# EAGLE design sce (EAGLE 6.2)
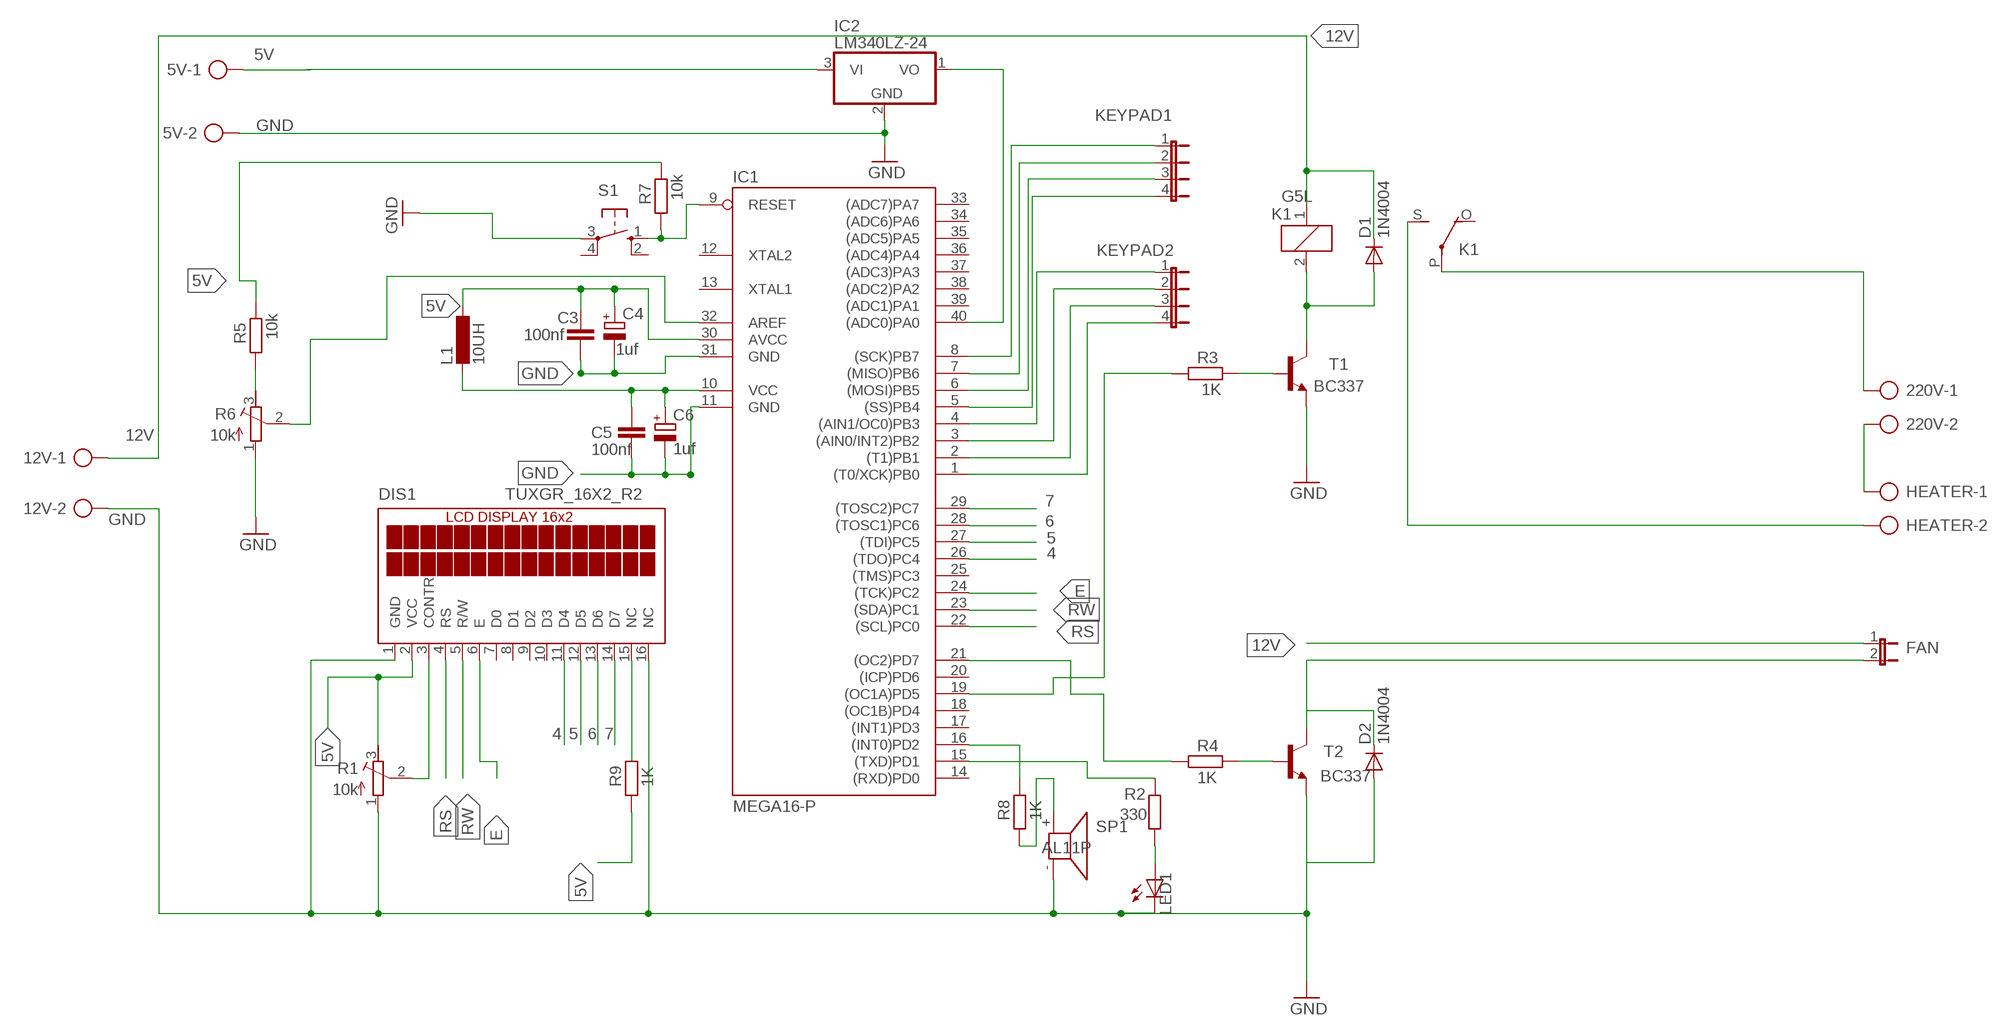
[diagram p0: schematic, sheet 1]

## Parts
5V  AK500/2  [AK500/2]
12V  AK500/2  [AK500/2]
220V  AK500/2  [AK500/2]
C3  100nf  C-EU025-025X050  [C025-025X050]
C4  1uf  CPOL-EUE2.5-5  [E2,5-5]
C5  100nf  C-EU025-025X050  [C025-025X050]
C6  1uf  CPOL-EUE2.5-5  [E2,5-5]
D1  1N4004  [DO41-10]
D2  1N4004  [DO41-10]
DIS1  TUXGR_16X2_R2  [TUXGR_16X2_R2]
FAN  JP1E  [JP1]
HEATER  AK500/2  [AK500/2]
IC1  MEGA16-P  [DIL40]
IC2  LM340LZ-24  [TO92]
K1  G5L  [G5LE]
KEYPAD1  JP4E  [JP4]
KEYPAD2  JP4E  [JP4]
L1  10UH  L-EU6000-XXX-RC  [6000-XXXX-RC]
LED1  LED5MM  [LED5MM]
R1  10k  R-TRIMM3339P  [RTRIM3339P]
R2  330  R-EU_0207/10  [0207/10]
R3  1K  R-EU_0207/10  [0207/10]
R4  1K  R-EU_0207/10  [0207/10]
R5  10k  R-EU_0207/10  [0207/10]
R6  10k  R-TRIMM3339P  [RTRIM3339P]
R7  10k  R-EU_0207/10  [0207/10]
R8  1K  R-EU_0207/10  [0207/10]
R9  1K  R-EU_0207/10  [0207/10]
S1  10-XX  [B3F-10XX]
SP1  AL11P  [AL11P]
T1  BC337  [TO92]
T2  BC337  [TO92]

## Nets
1: C5.1 C6.+ IC1.10(VCC) L1.2
4: DIS1.11(D4) IC1.26((TDO)PC4)
5: DIS1.12(D5) IC1.27((TDI)PC5)
5V: 5V.1 C3.1 C4.+ DIS1.2(VCC) IC1.30(AVCC) IC2.3(VI) L1.1 R1.3(E) R5.2 R7.2 R9.1
6: DIS1.13(D6) IC1.28((TOSC1)PC6)
7: DIS1.14(D7) IC1.29((TOSC2)PC7)
12V: 12V.1 D1.C FAN.1 K1.1
E: DIS1.6(E) IC1.24((TCK)PC2)
GND: 5V.2 12V.2 C3.2 C4.- C5.2 C6.- D2.A DIS1.1(GND) DIS1.16(NC) IC1.11(GND) IC1.31(GND) IC2.2(GND) LED1.K(C) R1.1(A) R6.1(A) SP1.- T1.1(E) T2.1(E)
HOT: IC1.40((ADC0)PA0) IC2.1(VO)
KEYPAD2: IC1.1((T0/XCK)PB0) KEYPAD2.4
N$1: S1.3(P) ; supply symbol labelled GND
N$2: IC1.9(RESET) R7.1 S1.1(S)
N$3: R4.2 T2.2(B)
N$4: R3.2 T1.2(B)
N$5: IC1.21((OC2)PD7) R4.1
N$6: IC1.3((AIN0/INT2)PB2) KEYPAD2.2
N$7: IC1.19((OC1A)PD5) R3.1
N$8: D1.A K1.2 T1.3(C)
N$9: IC1.5((SS)PB4) KEYPAD1.4
N$10: 220V.1 K1.P(2:P)
N$11: 220V.2 HEATER.1
N$12: IC1.16((INT0)PD2) R8.2
N$13: IC1.2((T1)PB1) KEYPAD2.3
N$14: HEATER.2 K1.S(2:S)
N$15: IC1.4((AIN1/OC0)PB3) KEYPAD2.1
N$16: D2.C FAN.2 T2.3(C)
N$17: IC1.15((TXD)PD1) R2.2
N$18: DIS1.3(CONTR) R1.2(S)
N$19: IC1.6((MOSI)PB5) KEYPAD1.3
N$20: LED1.A R2.1
N$21: IC1.7((MISO)PB6) KEYPAD1.2
N$22: R8.1 SP1.+
N$23: IC1.8((SCK)PB7) KEYPAD1.1
N$24: IC1.32(AREF) R6.2(S)
N$25: R5.1 R6.3(E)
N$26: DIS1.15(NC)
RS: DIS1.4(RS) IC1.22((SCL)PC0)
RW: DIS1.5(R/W) IC1.23((SDA)PC1)
Unconnected: DIS1.7(D0) DIS1.8(D1) DIS1.9(D2) DIS1.10(D3) IC1.12(XTAL2) IC1.13(XTAL1) IC1.14((RXD)PD0) IC1.17((INT1)PD3) IC1.18((OC1B)PD4) IC1.20((ICP)PD6) IC1.25((TMS)PC3) IC1.33((ADC7)PA7) IC1.34((ADC6)PA6) IC1.35((ADC5)PA5) IC1.36((ADC4)PA4) IC1.37((ADC3)PA3) IC1.38((ADC2)PA2) IC1.39((ADC1)PA1) K1.O(2:O) R9.2 S1.2(S1) S1.4(P1)

## Library data of the parts
5V 12V 220V HEATER = con-ptr500:AK500/2: CONNECTOR; OC_FARNELL: unknown; OC_NEWARK: unknown
C3 C5 = rcl:C-EU: CAPACITOR, European symbol
C4 C6 = rcl:CPOL-EU: POLARIZED CAPACITOR, European symbol
D1 D2 = diode:1N4004: DIODE general purpose rectifier, 1 A
DIS1 = display-lcd:TUXGR_16X2_R2: Tuxgraphics LCD display 16x2 characters reflective, without background light Source: tuxgr_12x2_r2.pdf; OC_FARNELL: unknown; OC_NEWARK: unknown
FAN = jumper:JP1E: JUMPER
IC1 = atmel:MEGA16-P: MICROCONTROLLER 16 Kbytes FLASH 1 kbytes SRAM 512 bytes EEPROM USART 8-channel 10 bit ADC Source: avr.lbr; MPN: ATMEGA16-16PU; OC_FARNELL: 9171142; OC_NEWARK: 01M6885
IC2 = linear:LM340?-*: Positive VOLTAGE REGULATOR Source: http://cache.national.com/ds/LM/LM340.pdf
K1 = relay:G5L: RELAY 1 x switch, 10 A/120 V AC, 8 A/30 V ADC, Omron; OC_FARNELL: unknown; OC_NEWARK: unknown
KEYPAD1 KEYPAD2 = jumper:JP4E: JUMPER
L1 = rcl:L-EU: INDUCTOR, European symbol
LED1 = led:LED: LED OSRAM: - CHIPLED LG R971, LG N971, LY N971, LG Q971, LY Q971, LO R971, LY R971 LH N974, LH R974 LS Q976, LO Q976, LY Q976 LO Q996 - Hyper CHIPLED LW Q18S LB Q993, LB Q99A, LB R99A - SideLED LS A670, LO A670, LY A670, LG A670, LP A670 LB A673, LV A673, LT A673, LW A673 LH A674 LY A675 LS A676, LA A676, LO A676, LY A676, LW A676 LS A679, LY A679, LG A679 - Hyper Micro SIDELED® LS Y876, LA Y876, LO Y876, LY Y876 LT Y87S - SmartLED LW L88C, LW L88S LB L89C, LB L89S, LG L890 LS L89K, LO L89K, LY L89K LS L896, LA L896, LO L896, LY L896 - TOPLED LS T670, LO T670, LY T670, LG T670, LP T670 LSG T670, LSP T670, LSY T670, LOP T670, LYG T670 LG T671, LOG T671, LSG T671 LB T673, LV T673, LT T673, LW T673 LH T674 LS T676, LA T676, LO T676, LY T676, LB T676, LH T676, LSB T676, LW T676 LB T67C, LV T67C, LT T67C, LS T67K, LO T67K, LY T67K, LW E67C LS E67B, LA E67B, LO E67B, LY E67B, LB E67C, LV E67C, LT E67C LW T67C LS T679, LY T679, LG T679 LS T770, LO T770, LY T770, LG T770, LP T770 LB T773, LV T773, LT T773, LW T773 LH T774 LS E675, LA E675, LY E675, LS T675 LS T776, LA T776, LO T776, LY T776, LB T776 LHGB T686 LT T68C, LB T68C - Hyper Mini TOPLED® LB M676 - Mini TOPLED Santana® LG M470 LS M47K, LO M47K, LY M47K Source: http://www.osram.convergy.de LUXEON: - LUMILED® LXK2-PW12-R00, LXK2-PW12-S00, LXK2-PW14-U00, LXK2-PW14-V00 LXK2-PM12-R00, LXK2-PM12-S00, LXK2-PM14-U00 LXK2-PE12-Q00, LXK2-PE12-R00, LXK2-PE12-S00, LXK2-PE14-T00, LXK2-PE14-U00 LXK2-PB12-K00, LXK2-PB12-L00, LXK2-PB12-M00, LXK2-PB14-N00, LXK2-PB14-P00, LXK2-PB14-Q00 LXK2-PR12-L00, LXK2-PR12-M00, LXK2-PR14-Q00, LXK2-PR14-R00 LXK2-PD12-Q00, LXK2-PD12-R00, LXK2-PD12-S00 LXK2-PH12-R00, LXK2-PH12-S00 LXK2-PL12-P00, LXK2-PL12-Q00, LXK2-PL12-R00 Source: www.luxeon.com KINGBRIGHT: KA-3528ASYC Source: www.kingbright.com
R1 R6 = rcl:R-TRIMM: Trimm resistor
R2-R5 R7-R9 = rcl:R-EU_: RESISTOR, European symbol
S1 = switch-omron:10-XX: OMRON SWITCH; MPN: B3F-1000; OC_FARNELL: 176432; OC_NEWARK: 36M3542
SP1 = buzzer:AL11P: SPEAKER Source: Buerklin; OC_FARNELL: unknown; OC_NEWARK: unknown
T1 T2 = transistor:BC337: NPN TRANSISTOR

## Board
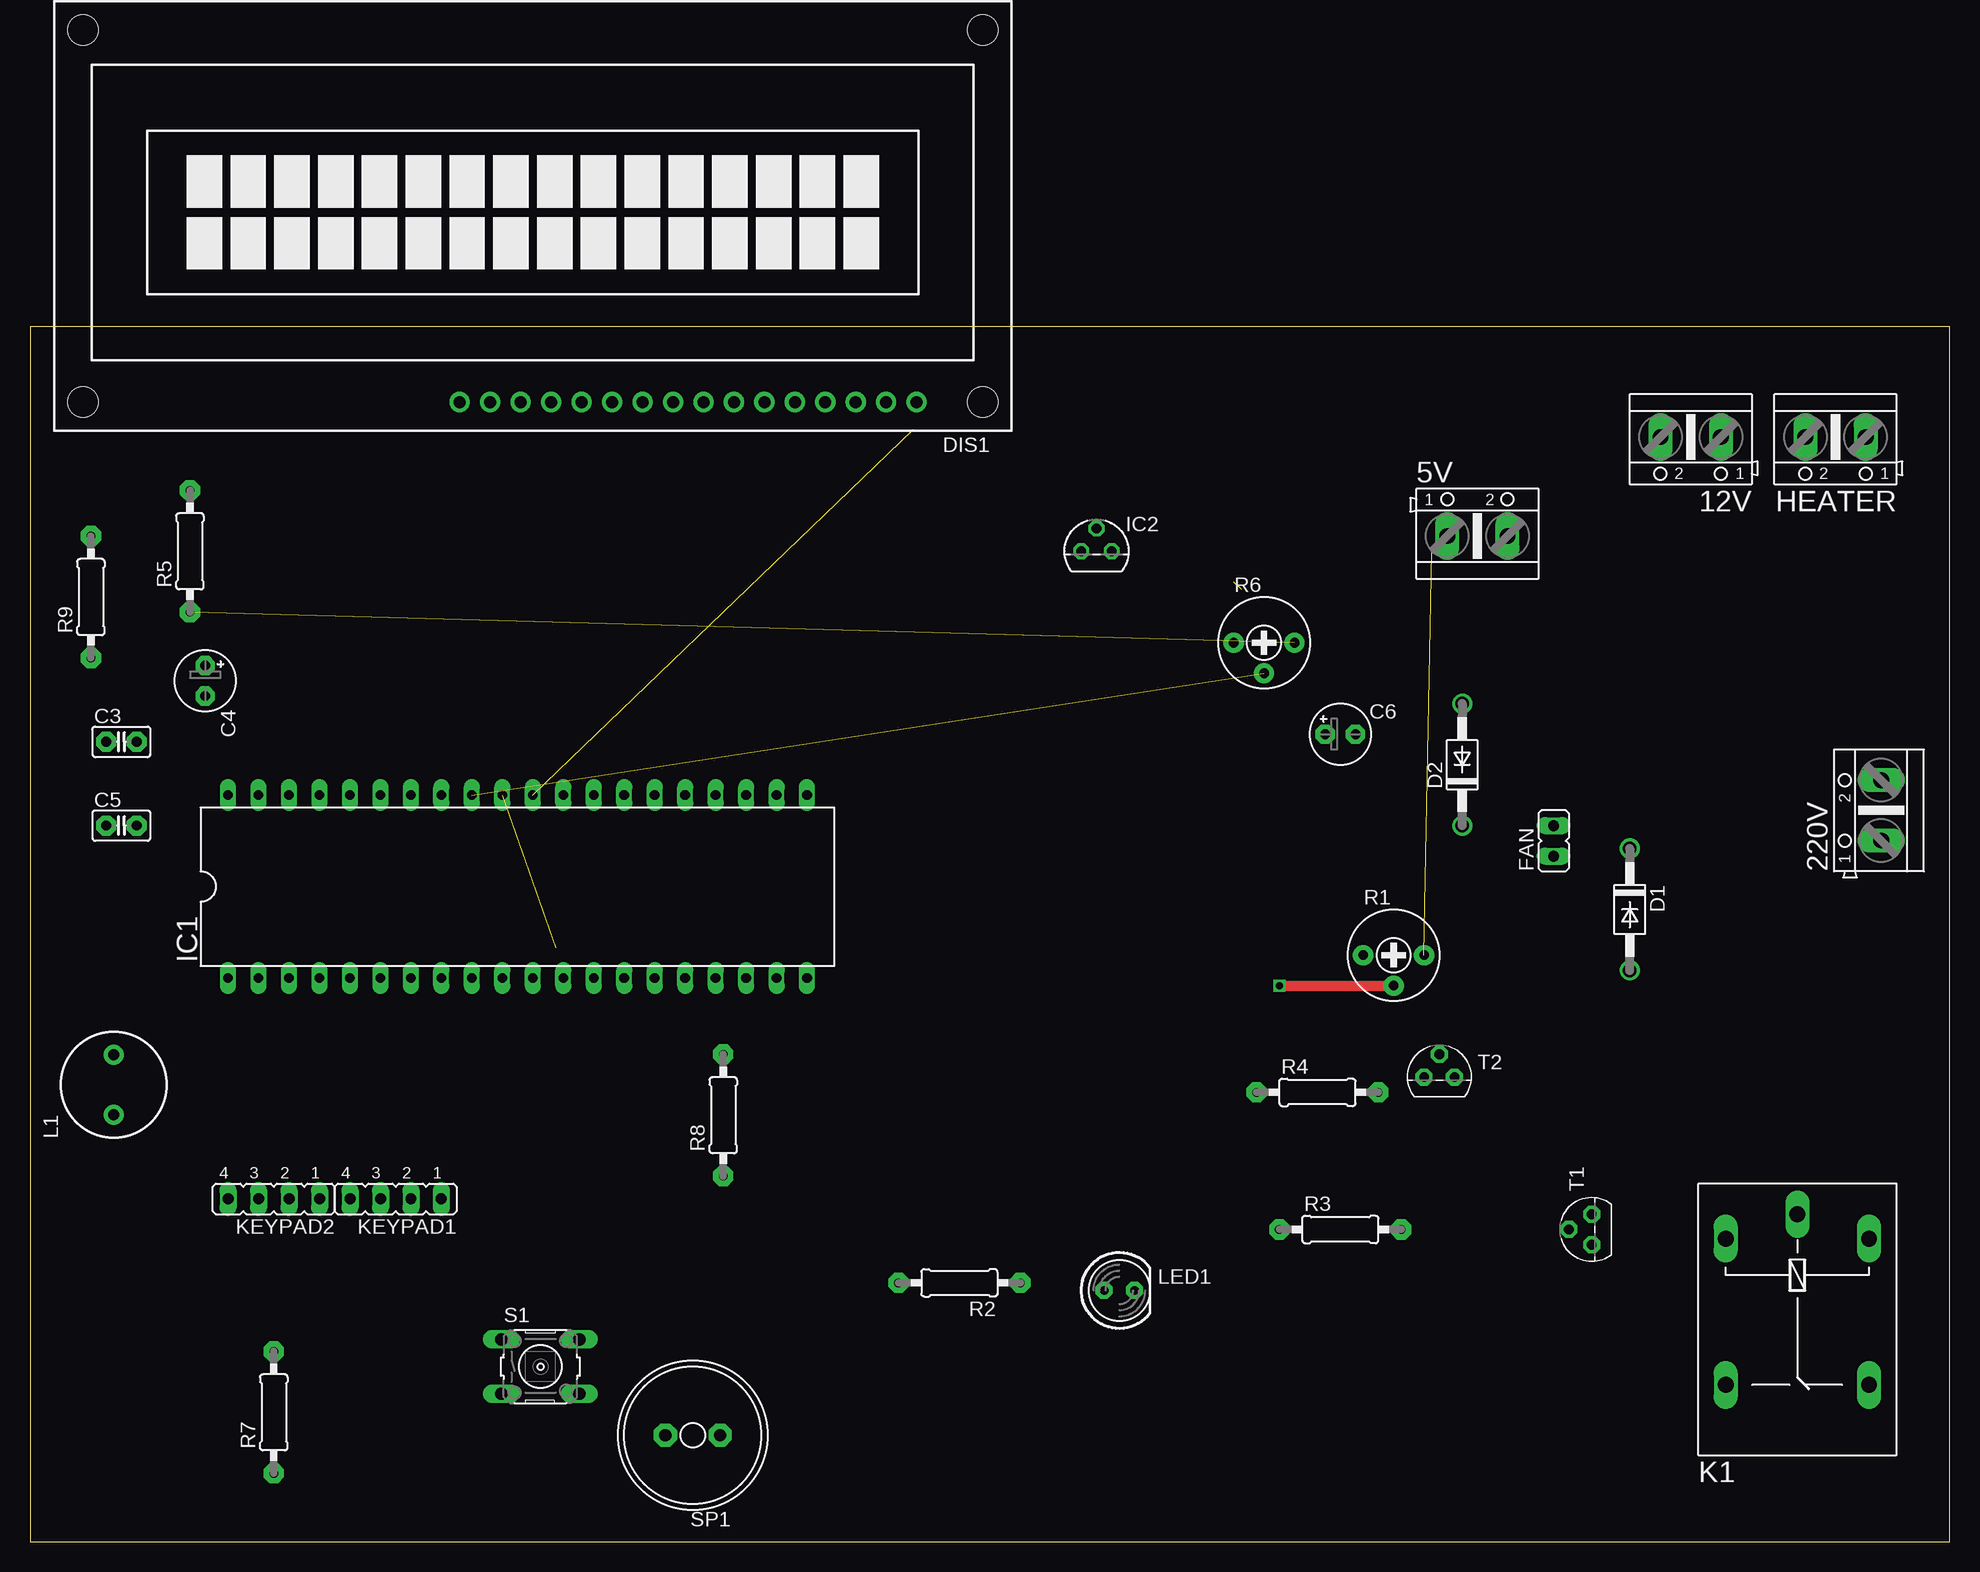
[diagram p1: board, top side]
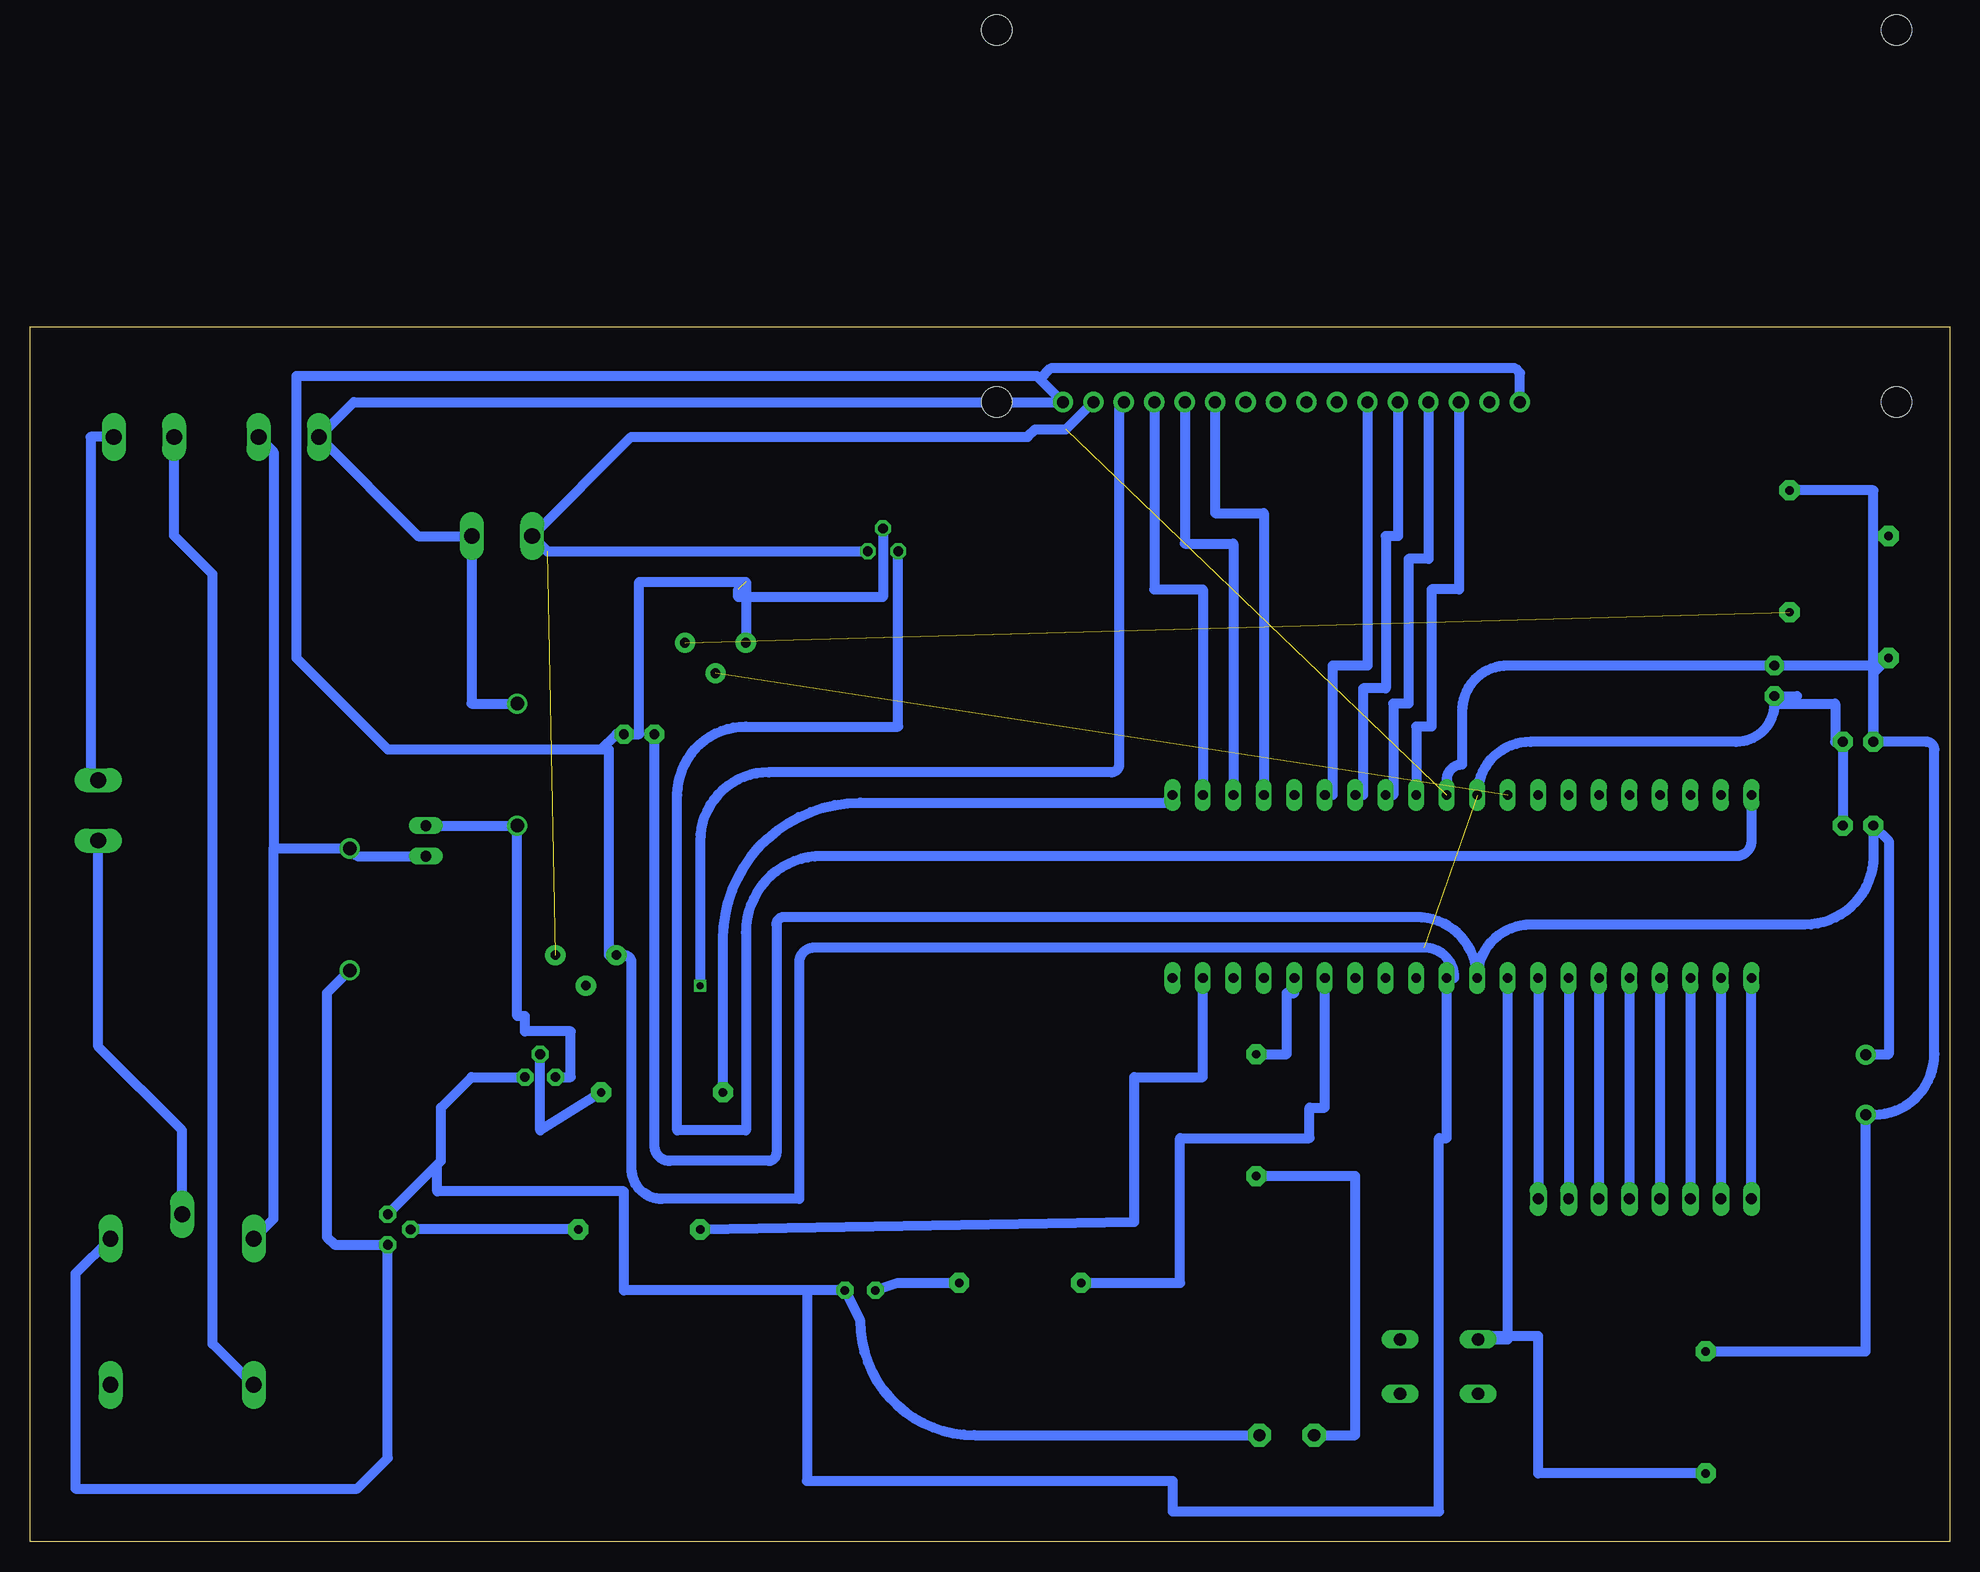
[diagram p2: board, bottom side, seen from below]

Size 160 x 101.27 mm. Coordinates in mm from the lower left corner, seen from the top.
Outline: 0,0 160,0 160,101.27 0,101.27 0,0
Copper layers (1*16): Top 0.035mm / dielectric 1.5mm / Bottom 0.035mm
Design rules: minimum track width 10mil, minimum drill 24mil, track to track 8mil, track to pad 8mil, pad to pad 8mil, via to via 8mil, smd to smd 8mil, copper to edge 40mil, drill to drill 8mil, minimum pad ring 10mil, minimum via ring 8mil, stop-mask expansion 4mil, vias tented up to drill 0mil, thermal gap 10mil

### Footprints (pad centres in the part's own frame; a part is rotated, then mirrored left to right if it is on the bottom)
AK500/2 = drill 1.321 long: 1 -2.515,0; 2 2.515,0
C025-025X050 = drill 0.813 pad 1.676 octagon: 1 -1.27,0; 2 1.27,0
E2,5-5 = drill 0.813 pad 1.6 octagon: + -1.27,0; - 1.27,0
DO41-10 = drill 1.118: A 5.08,0; C -5.08,0
TUXGR_16X2_R2 = drill 1 pad 1.676: 1 -32,15.5; 2 -29.46,15.5; 3 -26.92,15.5; 4 -24.38,15.5; 5 -21.84,15.5; 6 -19.3,15.5; 7 -16.76,15.5; 8 -14.22,15.5; 9 -11.68,15.5; 10 -9.14,15.5; 11 -6.6,15.5; 12 -4.06,15.5; 13 -1.52,15.5; 14 1.02,15.5; 15 3.56,15.5; 16 6.1,15.5 | hole 2.5: -37.5,-15.5; 37.5,-15.5; -37.5,15.5; 37.5,15.5
JP1 = drill 0.914 long: 1 0,-1.27; 2 0,1.27
DIL40 = drill 0.813 long: 1 -24.13,-7.62; 2 -21.59,-7.62; 3 -19.05,-7.62; 4 -16.51,-7.62; 5 -13.97,-7.62; 6 -11.43,-7.62; 7 -8.89,-7.62; 8 -6.35,-7.62; 9 -3.81,-7.62; 10 -1.27,-7.62; 11 1.27,-7.62; 12 3.81,-7.62; 13 6.35,-7.62; 14 8.89,-7.62; 15 11.43,-7.62; 16 13.97,-7.62; 17 16.51,-7.62; 18 19.05,-7.62; 19 21.59,-7.62; 20 24.13,-7.62; 21 24.13,7.62; 22 21.59,7.62; 23 19.05,7.62; 24 16.51,7.62; 25 13.97,7.62; 26 11.43,7.62; 27 8.89,7.62; 28 6.35,7.62; 29 3.81,7.62; 30 1.27,7.62; 31 -1.27,7.62; 32 -3.81,7.62; 33 -6.35,7.62; 34 -8.89,7.62; 35 -11.43,7.62; 36 -13.97,7.62; 37 -16.51,7.62; 38 -19.05,7.62; 39 -21.59,7.62; 40 -24.13,7.62
TO92 = drill 0.813 octagon: 1 -1.27,0; 2 0,1.905; 3 1.27,0
G5LE = drill 1.321 long: 1 -7.493,-5.969; 2 -7.493,5.969; O 4.699,5.969; P -9.525,0; S 4.699,-5.969
JP4 = drill 0.914 long: 1 -3.81,0; 2 -1.27,0; 3 1.27,0; 4 3.81,0
6000-XXXX-RC = drill 0.9 pad 1.676: 1 -2.5,0; 2 2.5,0
LED5MM = drill 0.7 pad 1.422 octagon: A -1.27,0; K 1.27,0
RTRIM3339P = drill 0.8 pad 1.676: 1 -2.54,0; 2 0,-2.54; 3 2.54,0
0207/10 = drill 0.7 pad 1.676 octagon: 1 -5.08,0; 2 5.08,0
B3F-10XX = drill 1.016 long: 1 -3.251,2.261; 2 3.251,2.261; 3 -3.251,-2.261; 4 3.251,-2.261
AL11P = drill 1.016 pad 1.93 octagon: + 2.286,0; - -2.286,0
TO92' = drill 0.813 pad 1.422 octagon: 1 1.27,0; 2 0,1.905; 3 -1.27,0

### Placement (x,y rotation side)
5V  120.65,83.82 0 top
12V  138.43,92.08 180 top
220V  154.31,60.96 90 top
C3  7.62,66.67 0 top
C4  14.61,71.75 270 top
C5  7.62,59.69 0 top
C6  109.22,67.31 0 top
D1  133.35,52.7 270 top
D2  119.38,64.77 90 top
DIS1  41.91,110.49 180 top
FAN  127,58.42 0 top
HEATER  150.5,92.08 180 top
IC1  40.64,54.61 0 top
IC2  88.9,82.55 0 top
K1  147.32,17.78 270 top
KEYPAD1  30.48,28.57 180 top
KEYPAD2  20.32,28.57 180 top
L1  6.99,38.1 90 top
LED1  90.81,20.95 0 top
R1  113.67,48.9 0 top
R2  77.47,21.59 180 top
R3  109.22,26.04 0 top
R4  107.31,37.47 0 top
R5  13.34,82.55 90 top
R6  102.87,74.93 0 top
R7  20.32,10.79 90 top
R8  57.78,35.56 90 top
R9  5.08,78.74 90 top
S1  42.55,14.61 0 top
SP1  55.24,8.89 180 top
T1  BC337  [TO92']  130.18,26.04 90 top
T2  BC337  [TO92']  117.47,38.73 0 top

### Tracks (layer width: path | path; a pad name or v marks a point on that pad's centre or on a via)
1
  Bottom 0.813: L1.2 5.12,40.6 5.08,40.64 5.08,58.42 C5.1 6.35,57.15 arc90 12.06,51.44 34.92,51.44 arc-90 IC1.10 arc-90 44.45,52.07 97.16,52.07 arc-90 97.79,51.44 97.79,32.38 arc90 98.42,31.75 106.68,31.75 arc90 107.95,33.02 C6.+
4
  Bottom 0.813: DIS1.11 48.51,73.03 51.44,73.03 51.44,62.23 IC1.26
5
  Bottom 0.813: DIS1.12 45.97,83.82 46.99,83.82 46.99,71.12 48.9,71.12 48.9,62.23 IC1.27
5V  (2 unrouted)
  Bottom 0.813: DIS1.2 73.66,92.71 76.2,92.71 76.83,92.08 109.88,92.08 5V.1 116.86,82.55 IC2.3 | R9.1 6.35,72.39 | 6.35,72.39 C3.1 | 6.35,72.39 6.35,73.03 C4.+ 36.83,73.03 arc-90 40.64,69.22 40.64,64.77 arc-90 41.91,63.5 IC1.30 | C3.1 6.35,87.63 R5.2 | R7.2 6.99,15.88 L1.1 6.31,35.6 arc-90 1.27,40.64 1.27,66.04 arc-90 1.91,66.67 C3.1
6
  Bottom 0.813: DIS1.13 43.43,81.92 45.09,81.92 45.09,69.85 46.35,69.85 46.35,62.23 IC1.28
7
  Bottom 0.813: DIS1.14 40.89,79.38 43.18,79.38 43.18,67.94 44.45,67.94 IC1.29
12V
  Bottom 0.813: K1.1 139.7,26.92 139.7,57.78 | 139.7,57.78 D1.C 132.72,57.15 FAN.1 | 12V.1 139.7,90.83 139.7,57.78
E
  Bottom 0.813: DIS1.6 61.21,85.72 57.15,85.72 IC1.24
GND  (2 unrouted)
  Bottom 0.813: D2.A 123.19,69.85 123.19,83.8 5V.2 127.66,83.82 12V.2 133,94.99 DIS1.1 75.82,96.9 | T1.1 126.05,31.43 | 126.05,31.43 125.73,31.75 125.73,36.2 123.19,38.73 T2.1 | C5.2 C3.2 9.53,66.67 9.53,69.85 14.61,69.85 | 75.82,96.9 76.08,97.16 137.79,97.16 137.79,73.66 130.18,66.04 112.39,66.04 | 112.39,66.04 111.12,67.31 C6.- 109.22,67.31 109.22,80.01 100.33,80.01 R6.1 | 14.61,69.85 C4.- 12.7,70.48 | SP1.- 81.28,8.89 arc90 90.81,18.41 LED1.K 95.25,20.95 | 95.25,20.95 95.25,5.08 64.77,5.08 64.77,2.54 42.55,2.54 42.55,33.66 41.91,33.66 IC1.11 41.27,46.99 arc-90 43.81,49.53 94.61,49.53 arc-90 95.89,48.26 95.89,28.57 107.31,28.57 arc90 109.86,31.11 109.86,48.26 arc-90 110.49,48.9 R1.1 111.76,48.9 111.76,66.04 112.39,66.04 | 95.25,20.95 110.49,20.95 110.49,29.21 126.05,29.21 126.05,31.43 | IC2.2 88.9,78.74 100.97,78.74 100.97,79.38 | DIS1.16 35.81,97.41 36.2,97.79 74.93,97.79 75.82,96.9 | 14.61,69.85 arc90 17.78,66.67 34.92,66.67 arc-90 IC1.31
HOT
  Bottom 0.813: IC1.40 16.51,58.42 arc90 17.78,57.15 93.98,57.15 arc-90 100.33,50.8 100.33,34.29 106.05,34.29 106.05,62.23 arc90 100.33,67.94 87.63,67.94 IC2.1
KEYPAD2
  Bottom 0.813: KEYPAD2.4 IC1.1
N$2
  Bottom 0.813: R7.1 34.29,5.71 34.29,17.14 39.29,17.14 S1.1 36.83,16.87 IC1.9
N$3
  Bottom 0.813: R4.2 117.47,34.29 T2.2
N$4
  Bottom 0.813: R3.2 T1.2
N$5
  Bottom 0.813: R4.1 102.23,50.16 arc90 90.81,61.59 65.41,61.59 arc-90 IC1.21
N$6
  Bottom 0.813: IC1.3 KEYPAD2.2
N$7
  Bottom 0.813: R3.1 67.94,26.67 67.94,38.73 62.23,38.73 IC1.19
N$8
  Bottom 0.813: K1.2 156.21,22.35 156.21,4.45 132.72,4.45 130.18,6.99 T1.3 134.62,24.77 135.25,25.4 135.25,45.72 D1.A
N$9
  Bottom 0.813: IC1.5 KEYPAD1.4
N$10
  Bottom 0.813: K1.P 147.32,34.29 154.31,41.27 220V.1
N$11
  Bottom 0.813: HEATER.1 154.94,92.08 154.94,63.5 154.31,63.5 220V.2
N$12
  Bottom 0.813: R8.2 55.24,40.64 55.24,45.72 54.61,45.72 IC1.16
N$13
  Bottom 0.813: IC1.2 KEYPAD2.3
N$14
  Bottom 0.813: K1.S 144.78,16.51 144.78,80.64 147.98,83.84 HEATER.2
N$15
  Bottom 0.813: IC1.4 KEYPAD2.1
N$16
  Bottom 0.813: FAN.2 D2.C 119.38,43.81 118.75,43.81 118.75,42.55 114.94,42.55 114.94,38.73 T2.3
N$17
  Bottom 0.813: R2.2 64.14,21.59 64.14,33.66 53.34,33.66 53.34,36.2 52.07,36.2 IC1.15
N$18  (via drill 0.6)
  Top 0.813: v104.14,46.35 R1.2
  Bottom 0.813: DIS1.3 arc-90 69.22,94.61 69.22,64.77 arc90 69.85,64.14 98.42,64.14 arc-90 104.14,58.42 v104.14,46.35
N$19
  Bottom 0.813: IC1.6 KEYPAD1.3
N$20
  Bottom 0.813: LED1.A 87.63,21.59 R2.1
N$21
  Bottom 0.813: IC1.7 KEYPAD1.2
N$22
  Bottom 0.813: SP1.+ 49.53,8.89 49.53,30.48 R8.1
N$23
  Bottom 0.813: IC1.8 KEYPAD1.1
N$24  (1 unrouted)
N$25  (1 unrouted)
RS
  Bottom 0.813: DIS1.4 66.29,79.38 62.23,79.38 IC1.22
RW
  Bottom 0.813: DIS1.5 63.75,83.19 59.69,83.19 IC1.23